# Altium schematic sheet Power_Pos.SchDoc
size A4; DocumentNumber: 2; SheetNumber: 2; SheetTotal: 11
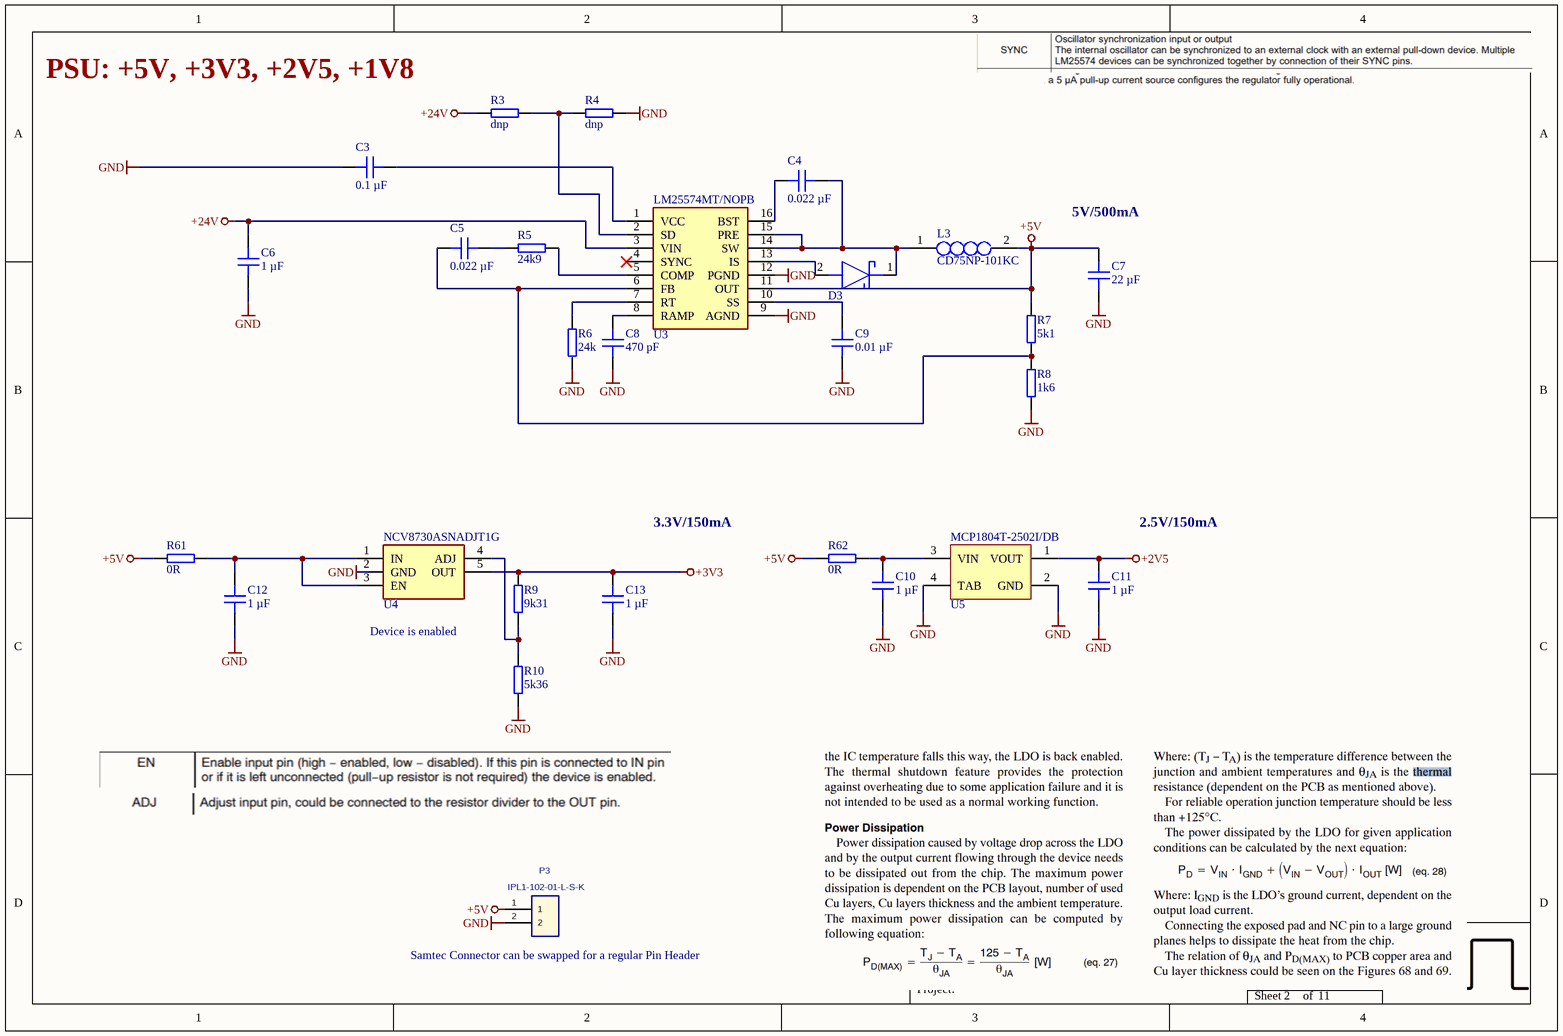
[diagram p0: Power_Pos.SchDoc]

## Parts
C3  0.1 µF  [C_0603]
C4  0.022 µF  [C_0805]
C5  0.022 µF  [C_0805]
C6  1 µF  [C_1206]
C7  22 µF  [C_0805]
C8  470 pF  [C_0805]
C9  0.01 µF  [C_0603]
C10  1 µF  [C_1206]
C11  1 µF  [C_1206]
C12  1 µF  [C_1206]
C13  1 µF  [C_1206]
D3  CDBA260-G  [DIOM5226X262N]  (value not drawn)
L3  CD75NP-101KC  [784787121]
P3  IPL1-102-01-L-S-K  [IPL1-102-01-YYY-S-K]
R3  dnp  [RES 0603_1608]
R4  dnp  [RES 0603_1608]
R5  24k9  [RES 0603_1608]
R6  24k  [RES 0603_1608]
R7  5k1  [RES 0603_1608]
R8  1k6  [RES 0603_1608]
R9  9k31  [RES 0603_1608]
R10  5k36  [RES 0603_1608]
R61  0R  [RES 0603_1608]
R62  0R  [RES 0603_1608]
U3  LM25574MT/NOPB  [SOP65P640X120-16N]
U4  NCV8730ASNADJT1G  [SOT95P275X110-5N]
U5  MCP1804T-2502I/DB  [SOT-223-DB3_N]

## Nets
+2V5: C11.2 U5.1(VOUT)
+3V3: C13.2 R9.2 U4.5(OUT)
+5V: C7.2 L3.2 P3.1 R7.2 R61.1 R62.1 U3.11(OUT)
+24V: C6.2 R3.1 U3.3(VIN)
GND: C3.2 C6.1 C7.1 C8.1 C9.1 C10.1 C11.1 C12.1 C13.1 P3.2 R4.2 R6.1 R8.1 R10.1 U3.9(AGND) U3.12(PGND) U4.2(GND) U5.2(GND) U5.4(TAB)
NetC3_1: C3.1 U3.1(VCC)
NetC4_1: C4.1 U3.16(BST)
NetC4_2: C4.2 D3.1(K) L3.1 U3.14(SW) U3.15(PRE)
NetC5_1: C5.1 R7.1 R8.2 U3.6(FB)
NetC5_2: C5.2 R5.1
NetC8_2: C8.2 U3.8(RAMP)
NetC9_2: C9.2 U3.10(SS)
NetC10_2: C10.2 R62.2 U5.3(VIN)
NetC12_2: C12.2 R61.2 U4.1(IN) U4.3(EN)
NetD3_2: D3.2(A) U3.13(IS)
NetR3_2: R3.2 R4.1 U3.2(SD)
NetR5_2: R5.2 U3.5(COMP)
NetR6_2: R6.2 U3.7(RT)
NetR9_1: R9.1 R10.2 U4.4(ADJ)

Not connected (* = marked no-connect by the designer): U3 4(SYNC)*

## Notes on the sheet
- PSU: +5V, +3V3, +2V5, +1V8
- (near C7) 5V/500mA
- 3.3V/150mA
- 2.5V/150mA
- Device is enabled
- (near P3) Samtec Connector can be swapped for a regular Pin Header
- Title
- Revision:
- Design Engineer:
- Date:
- Project:
- Sheet
- of

## Library data of the parts
C3 = C0603X104K5RAC7411: Capacitor 0603, 50 VDC, 0.1 µF, X7R; Manufacturer: KEMET; Tolerance: 10 %; Voltage Rating: 50 VDC; Created from: MGremer; Manufacturer Part Number: C0603X104K5RAC7411; PartID: 3; Created On: 20.12.2020 13:54:13; ComponentLink1Description: Datasheet; ComponentLink1URL: https://www.mouser.de/datasheet/2/212/1/KEM_C1013_X7R_FT_CAP_SMD-1103280.pdf; Component Type: Capacitor 0603; Device Package: 0603; Last Updated: 04.03.2021 09:24:28; Mounting Type: SMD; Operating Temperature: -55 - 125°C; Series: SMD Comm X7R Flex; Supplier 1: Mouser; Supplier Part Number 1: 80-C0603X104K5R7411; Supplier 2: LCSC; Supplier Part Number 2: C14663; Type: Capacitor; Value: 0.1 µF; Live Cycle Status: 1; LCSC Part Number: C14663; Stock number: Labor SMD Container
C4 C5 = C0805J223K1RACAUTO: Capacitor 0805, 100 VDC, 0.022 µF, X7R; Manufacturer: KEMET; Tolerance: 10 %; Voltage Rating: 100 VDC; Created from: MGremer; Manufacturer Part Number: C0805J223K1RACAUTO; PartID: 42; Created On: 20.12.2020 13:54:13; ComponentLink1Description: Datasheet; ComponentLink1URL: https://www.mouser.de/datasheet/2/212/KEM_C1012_X7R_OPENMODE_SMD-1103265.pdf; Component Type: Capacitor 0805; Device Package: 0805; Last Updated: 04.03.2021 16:12:02; Mounting Type: SMD; Operating Temperature: -55 - 125°C; Series: SMD Auto X7R FO; Supplier 1: Mouser; Supplier Part Number 1: 80-C0805J223K1RCAUTO; Type: Capacitor; Value: 0.022 µF; Live Cycle Status: 1; Stock number: Labor SMD Container
C6 C10-C13 = C1206X105K5RECAUTO: Capacitor 1206, 50 VDC, 1 µF, X7R; Manufacturer: KEMET; Tolerance: 10 %; Voltage Rating: 50 VDC; Created from: MGremer; Manufacturer Part Number: C1206X105K5RECAUTO; PartID: 39; Created On: 20.12.2020 13:54:13; ComponentLink1Description: Datasheet; ComponentLink1URL: https://www.mouser.de/datasheet/2/212/1/KEM_C1090_X7R_ESD-1103328.pdf; Component Type: Capacitor 1206; Device Package: 1206; Last Updated: 20.12.2020 17:44:37; Mounting Type: SMD; Operating Temperature: -55 - 125°C; Series: ESD SMD Auto X7R; Supplier 1: Mouser; Supplier Part Number 1: 80-C1206X105K5REAUTO; Type: Capacitor; Value: 1 µF; Live Cycle Status: 1; Stock number: Labor SMD Container
C7 = GRT21BR61E226ME13L: Capacitor 0805, 25 VDC, 22 µF, X5R; Manufacturer: muRata; Tolerance: 20 %; Voltage Rating: 25 VDC; Created from: MGremer; Manufacturer Part Number: GRT21BR61E226ME13L; PartID: 12; Created On: 20.12.2020 13:54:13; ComponentLink1Description: Datasheet; ComponentLink1URL: https://www.mouser.de/datasheet/2/281/product-794362.pdf; Component Type: Capacitor 0805; Device Package: 0805; Last Updated: 20.12.2020 16:50:55; Mounting Type: SMD; Operating Temperature: -55 - 85°C; Series: GRT; Supplier 1: Mouser; Supplier Part Number 1: 81-GRT21BR61E226ME3L; Type: Capacitor; Value: 22 µF; Live Cycle Status: 1; Stock number: Labor SMD Container
C8 = CC805KRX7R9BB471: Capacitor 0805, 50 VDC, 470 pF, X7R; Manufacturer: FH; Tolerance: 10 %; Voltage Rating: 50	 VDC; Created from: MHlatky; Manufacturer Part Number: CC805KRX7R9BB471; PartID: 91; Created On: 20.12.2020 13:54:13; ComponentLink1Description: Datasheet; ComponentLink1URL: https://www.mouser.de/datasheet/2/447/UPY_GPHC_X7R_6_3V_to_50V_20-1995650.pdf; Component Type: Capacitor 0805; Device Package: 0805; Last Updated: 05.04.2022 16:54:33; Mounting Type: SMD; Operating Temperature: -55 - 125°C; Series: SMD Comm X7R; Supplier 1: Mouser; Supplier Part Number 1: 603-CC805KRX7R9BB471; Type: Capacitor; Value: 470 pF; Live Cycle Status: 1; Stock number: Labor SMD Container
C9 = GCJ188R71H103KA01D: Capacitor 0603, 50 VDC, 0.01 µF, X7R; Manufacturer: muRata; Tolerance: 10 %; Voltage Rating: 50 VDC; Created from: MGremer; Manufacturer Part Number: GCJ188R71H103KA01D; PartID: 1; Created On: 20.12.2020 13:54:13; ComponentLink1Description: Datasheet; ComponentLink1URL: https://www.mouser.de/datasheet/2/281/c03e-516224.pdf; Component Type: Capacitor 0603; Device Package: 0603; Last Updated: 20.12.2020 16:24:16; Mounting Type: SMD; Operating Temperature: -55 - 125°C; Series: GCJ; Supplier 1: Mouser; Supplier Part Number 1: 81-GCJ188R71H103KA1D; Type: Capacitor; Value: 0.01 µF; Live Cycle Status: 1; Stock number: Labor SMD Container
D3 = CDBA260-G: Schottky Diode, 60 V, 2 A; Manufacturer_Name: Central Semiconductor; Manufacturer_Part_Number: CMSH2-60M TR13 PBFREE; Forward Current: 2 A; Forward Voltage: 700mV; Reverse Current: 500 uA; Value: 60V; Created from: MHlatky; Datasheet Link: https://my.centralsemi.com/datasheets/CMSH2-20M_40M_60M_100M.PDF; Height: 2.62mm; Manufacturer Part Number: CDBA260-G; PartID: 9; Created On: 02.02.2021 14:22:37; ComponentLink1Description: Datasheet; ComponentLink1URL: https://www.mouser.de/datasheet/2/80/CDBA240_HF_Thru193240__CDBA2100_HF_RevC-2489669.pdf; Component Type: Schottky Diode; Device Package: SMA (DO-214AC); Last Updated: 22.03.2022 00:32:48; Manufacturer: Central Semiconductor; Mounting Type: SMD; Operating Temperature: -55 - 150 °C; Supplier 1: Mouser; Supplier Part Number 1: 750-CDBA260-G; Type: Schottky Diode; Live Cycle Status: 1; Stock number: not stored
L3 = CD75NP-101KC: SMD Power Inductor, 100uH; Manufacturer_Name: Wurth Elektronik; Manufacturer: Sumida; Type: Festinduktivität; DC current: 720 mA; Value: 430mOhm; Created from: MHlatky; Datasheet Link: https://www.we-online.com/catalog/datasheet/784787121.pdf; Height: 5mm; Manufacturer_Part_Number: 784787121; Manufacturer Part Number: CD75NP-101KC; PartID: 9; Created On: 18.11.2021 09:06:12; ComponentLink1Description: Datasheet; ComponentLink1URL: https://www.mouser.de/datasheet/2/390/CD75-465883.pdf; Component Type: SMD Power Inductor; Device Package: SMD; Last Updated: 05.04.2022 16:55:14; Mounting Type: SMD; Operating Temperature: -40 - 100 °C; Supplier 1: Mouser; Supplier Part Number 1: 851-CD75NP-101KC; Live Cycle Status: 1; Stock number: not stored
P3 = IPL1-102-01-L-S-K: 2.54 mm Single Row Terminal Assembly; Manufacturer: SAMTEC; Created from: MGremer; Number of positions: 2; Manufacturer Part Number: IPL1-102-01-L-S-K; PartID: 3; Created On: 27.11.2020 17:00:15; ComponentLink1Description: Homepage; ComponentLink1URL: https://www.samtec.com/products/ipl1; Component Type: Samtec Connector; Device Package: Connector; Last Updated: 01.04.2021 08:22:46; Mounting Type: THT; Supplier 1: SAMTEC; Supplier Part Number 1: IPL1-102-01-L-S-K; Supplier 2: Digi-Key; Supplier Part Number 2: SAM8824-ND; Type: Connector; Live Cycle Status: 1; Number of rows: 1; Stock number: not stored
R3 R4 = -: SMD resistor E24 series; Created from: MGremer; Manufacturer Part Number: -; PartID: 147; Created On: 14.12.2020 16:17:14; ComponentLink1Description: Datasheet; ComponentLink1URL: -; Component Type: SMD resistor; Device Package: 0603; Last Updated: 02.03.2021 14:07:32; Manufacturer: -; Mounting Type: SMD; Supplier 1: -; Supplier Part Number 1: -; Type: Resistor; Tolerance: -; Value: dnp; Live Cycle Status: 1; Stock number: Labor SMD Container
R5 = CRCW060324K9FKEA: SMD resistor 1%; Manufacturer: Vishay; Created from: MGremer; Manufacturer Part Number: CRCW060324K9FKEA; PartID: 157; Created On: 14.12.2020 16:17:14; ComponentLink1Description: Datasheet; ComponentLink1URL: https://www.mouser.de/datasheet/2/427/dcrcwe3-1762152.pdf; Component Type: SMD resistor; Device Package: 0603; Last Updated: 02.03.2021 14:07:32; Mounting Type: SMD; Supplier 1: Mouser; Supplier Part Number 1: 71-CRCW0603-24.9K-E3; Type: Resistor; Tolerance: 1%; Value: 24k9; Live Cycle Status: 1; Stock number: not stored
R6 = RK73B1JTTD243J: SMD resistor E24 series; Manufacturer: KOA Speer; Tolerance: 5%; Created from: MGremer; Manufacturer Part Number: RK73B1JTTD243J; PartID: 107; Created On: 14.12.2020 16:17:14; ComponentLink1Description: Datasheet; ComponentLink1URL: https://www.mouser.de/datasheet/2/219/RK73B-1825463.pdf; Component Type: SMD resistor; Device Package: 0603; Last Updated: 02.03.2021 14:07:32; Mounting Type: SMD; Supplier 1: Mouser; Supplier Part Number 1: 660-RK73B1JTTD243J; Type: Resistor; Value: 24k; Live Cycle Status: 1; Stock number: Labor SMD Container
R7 = RK73B1JTTDD512J: SMD resistor E24 series; Manufacturer: KOA Speer; Tolerance: 5%; Created from: MGremer; Manufacturer Part Number: RK73B1JTTDD512J; PartID: 91; Created On: 14.12.2020 16:17:14; ComponentLink1Description: Datasheet; ComponentLink1URL: https://www.mouser.de/datasheet/2/219/RK73B-1825463.pdf; Component Type: SMD resistor; Device Package: 0603; Last Updated: 02.03.2021 14:07:32; Mounting Type: SMD; Supplier 1: Mouser; Supplier Part Number 1: 660-RK73B1JTTDD512J; Type: Resistor; Value: 5k1; Live Cycle Status: 1; Stock number: Labor SMD Container
R8 = RK73B1JTTD162J: SMD resistor E24 series; Manufacturer: KOA Speer; Tolerance: 5%; Created from: MGremer; Manufacturer Part Number: RK73B1JTTD162J; PartID: 79; Created On: 14.12.2020 16:17:14; ComponentLink1Description: Datasheet; ComponentLink1URL: https://www.mouser.de/datasheet/2/219/RK73B-1825463.pdf; Component Type: SMD resistor; Device Package: 0603; Last Updated: 02.03.2021 14:07:32; Mounting Type: SMD; Supplier 1: Mouser; Supplier Part Number 1: 660-RK73B1JTTD162J; Type: Resistor; Value: 1k6; Live Cycle Status: 1; Stock number: Labor SMD Container
R9 = ERJ3EKF9311V: SMD resistor 1%; Manufacturer: Panasonic; Created from: MGremer; Manufacturer Part Number: ERJ3EKF9311V; PartID: 171; Created On: 14.12.2020 16:17:14; ComponentLink1Description: Datasheet; ComponentLink1URL: http://industrial.panasonic.com/cdbs/www-data/pdf/RDA0000/AOA0000C304.pdf; Component Type: SMD resistor; Device Package: 0603; Last Updated: 02.03.2021 14:07:32; Mounting Type: SMD; Supplier 1: Farnell; Supplier Part Number 1: 2059405; Type: Resistor; Tolerance: 1%; Value: 9k31; Live Cycle Status: 1; Stock number: not stored
R10 = AC0603FR-075K36L: SMD resistor 1%; Manufacturer: YAGEO; Created from: MGremer; Manufacturer Part Number: AC0603FR-075K36L; PartID: 195; Created On: 14.12.2020 16:17:14; ComponentLink1Description: Datasheet; ComponentLink1URL: https://www.mouser.de/datasheet/2/447/PYu_AC_51_RoHS_L_7-1714230.pdf; Component Type: SMD resistor; Device Package: 0603; Last Updated: 02.07.2021 11:49:34; Mounting Type: SMD; Supplier 1: Mouser; Supplier Part Number 1: 603-AC0603FR-075K36L; Type: Resistor; Tolerance: 1%; Value: 5k36; Live Cycle Status: 1; Stock number: not stored
R61 R62 = RC0603JR-070RL: SMD resistor E24 series; Manufacturer: YAGEO; Tolerance: 5%; Created from: MGremer; Manufacturer Part Number: RC0603JR-070RL; PartID: 1; Created On: 14.12.2020 16:17:14; ComponentLink1Description: Datasheet; ComponentLink1URL: https://www.mouser.de/datasheet/2/447/PYu-RC_Group_51_RoHS_L_10-1664068.pdf; Component Type: SMD resistor; Device Package: 0603; Last Updated: 04.03.2021 09:09:42; Mounting Type: SMD; Supplier 1: Mouser; Supplier Part Number 1: 603-RC0603JR-070RL; Supplier 2: LCSC; Supplier Part Number 2: C21189; Type: Resistor; Value: 0R; Live Cycle Status: 1; Stock number: Labor SMD Container; LCSC Part Number: C21189
U3 = LM25574MT/NOPB: 42-V, 0.5-A Step-Down Switching Regulator; Manufacturer_Name: Texas Instruments; Manufacturer: TI; Created from: MHlatky; Datasheet Link: http://www.ti.com/lit/ds/symlink/lm25574.pdf; Height: 1.2mm; Manufacturer_Part_Number: LM25574MT/NOPB; Manufacturer Part Number: LM25574MT/NOPB; PartID: 3; Created On: 03.03.2022 16:53:36; ComponentLink1Description: Datasheet; ComponentLink1URL: ti.com/general/docs/suppproductinfo.tsp?distId=26&gotoUrl=http%3A%2F%2Fwww.ti.com%2Flit%2Fgpn%2Flm25574; Component Type: LM25574; Last Updated: 08.03.2022 11:31:47; Mounting Type: SOP; Operating Temperature: -40 - 125; Supplier 1: Mouser; Supplier Part Number 1: 926-LM25574MT/NOPB; Type: Step-Down Switching Regulator; Live Cycle Status: 1
U4 = NCV8730ASNADJT1G: LDO Regulator, 150 mA, 38V, 1 A IQ, with PG; Manufacturer_Name: ON Semiconductor; Manufacturer: onsemi; Created from: MHlatky; Datasheet Link: https://www.arrow.com/en/products/ncv8730asnadjt1g/on-semiconductor; Height: 1.1mm; Manufacturer_Part_Number: NCV8730ASNADJT1G; Manufacturer Part Number: NCV8730ASNADJT1G; PartID: 6; Created On: 03.03.2022 16:53:36; ComponentLink1Description: Datasheet; ComponentLink1URL: https://www.mouser.de/datasheet/2/308/1/NCV8730_D-2317675.pdf; Component Type: NCV8730ASNADJT1G; Last Updated: 08.03.2022 11:32:43; Mounting Type: SOT; Operating Temperature: -40 - 125; Supplier 1: Mouser; Supplier Part Number 1: 863-NCV8730ASNADJT1G; Type: Voltage Reference; Live Cycle Status: 1
U5 = MCP1804T-2502I/DB: 150 mA, 28V LDO Regulator With Shutdown; Manufacturer: Microchip Technology; Created from: MHlatky; PackageDescription: 3-Lead Plastic Small Outline Transistor (DB) [SOT-223]; PackageVersion: revBB, Aug-2009; DatasheetVersion: revB, Nov-2009; PackageReference: SOT-223-DB3; Manufacturer Part Number: MCP1804T-2502I/DB; PartID: 12; Created On: 03.03.2022 16:53:36; ComponentLink1Description: Datasheet; ComponentLink1URL: https://www.mouser.de/datasheet/2/268/20002200D-1150037.pdf; Component Type: MCP1804T-2502I/DB; Last Updated: 08.03.2022 18:56:13; Mounting Type: SOT; Operating Temperature: -40 - 85; Supplier 1: Mouser; Supplier Part Number 1: 579-MCP1804T-2502IDB; Type: LDO with Shutdown; Live Cycle Status: 1